# EAGLE design W7IUV_preamp (EAGLE 7.7.0)
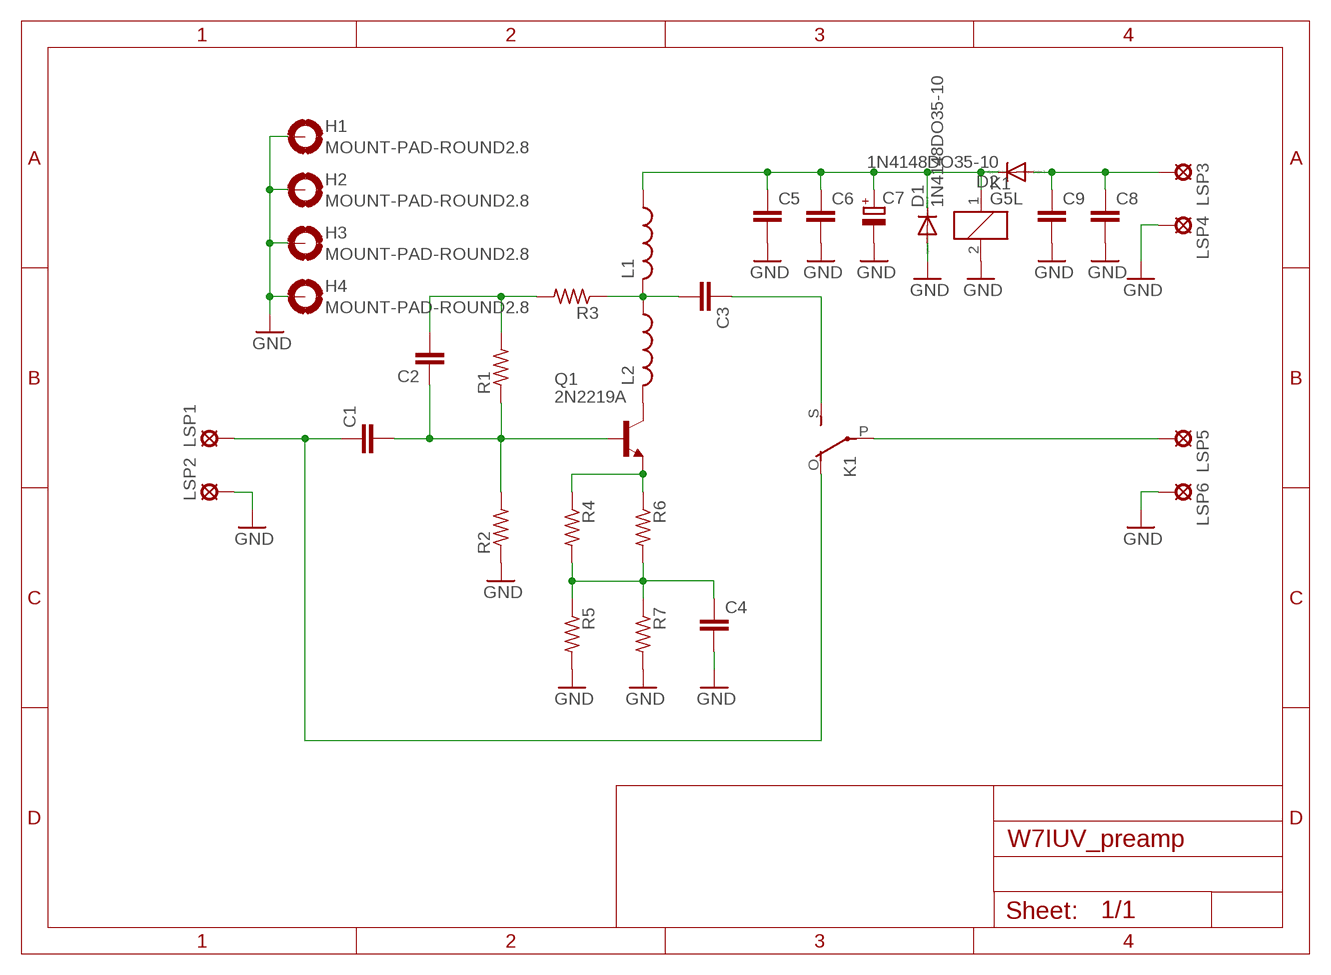
[diagram p0: schematic, sheet 1]

## Parts
C1  C-EUC1206  [C1206]
C2  C-EUC1206  [C1206]
C3  C-EUC1206  [C1206]
C4  C-EUC1206  [C1206]
C5  C-EUC1206  [C1206]
C6  C-EUC1206  [C1206]
C7  CPOL-EUE5-10.5  [E5-10,5]
C8  C-EUC1206  [C1206]
C9  C-EUC1206  [C1206]
D1  1N4148DO35-10  [DO35-10]
D2  1N4148DO35-10  [DO35-10]
H1  MOUNT-PAD-ROUND2.8  [2,8-PAD]
H2  MOUNT-PAD-ROUND2.8  [2,8-PAD]
H3  MOUNT-PAD-ROUND2.8  [2,8-PAD]
H4  MOUNT-PAD-ROUND2.8  [2,8-PAD]
K1  G5L  [G5LE]
L1  L-USLAN02KR  [LAN02KR]
L2  L-USLAN02KR  [LAN02KR]
LSP1  MCS08  [MCS08]
LSP2  MCS08  [MCS08]
LSP3  MCS08  [MCS08]
LSP4  MCS08  [MCS08]
LSP5  MCS08  [MCS08]
LSP6  MCS08  [MCS08]
Q1  2N2219A  [TO39]
R1  R-US_M1206  [M1206]
R2  R-US_M1206  [M1206]
R3  R-US_M1206  [M1206]
R4  R-US_M1206  [M1206]
R5  R-US_M1206  [M1206]
R6  R-US_M1206  [M1206]
R7  R-US_M1206  [M1206]

## Nets
GND: C4.2 C5.2 C6.2 C7.- C8.2 C9.2 D1.A H1.B2,8(MOUNT) H2.B2,8(MOUNT) H3.B2,8(MOUNT) H4.B2,8(MOUNT) K1.2 LSP2.MP LSP4.MP LSP6.MP R2.1 R5.2 R7.2
N$1: C4.1 R4.2 R5.1 R6.2 R7.1
N$2: Q1.1(E) R4.1 R6.1
N$3: C1.2 C2.1 Q1.2(B) R1.1 R2.2
N$4: C3.1 K1.S(2:S)
N$5: C2.2 R1.2 R3.2
N$6: C3.2 L1.2 L2.1 R3.1
N$7: L2.2 Q1.3(C)
N$8: C1.1 K1.O(2:O) LSP1.MP
N$9: K1.P(2:P) LSP5.MP
N$10: C5.1 C6.1 C7.+ D1.C D2.C K1.1 L1.1
N$11: C8.1 C9.1 D2.A LSP3.MP

## Library data of the parts
C1-C6 C8 C9 = rcl:C-EU: CAPACITOR, European symbol
C7 = rcl:CPOL-EU: POLARIZED CAPACITOR, European symbol
D1 D2 = diode:1N4148: DIODE high speed (Philips)
H1-H4 = holes:MOUNT-PAD-ROUND: MOUNTING PAD, round
K1 = relay:G5L: RELAY 1 x switch, 10 A/120 V AC, 8 A/30 V ADC, Omron; OC_FARNELL: unknown; OC_NEWARK: unknown
L1 L2 = rcl:L-US: INDUCTOR, American symbol
LSP1-LSP6 = solpad:MCS08: SOLDER PAD MC S0,8, drill 1.2 mm, distributor Buerklin, 08F130
Q1 = transistor-npn:2N2219A: NPN Transistor
R1-R7 = rcl:R-US_: RESISTOR, American symbol

## Board
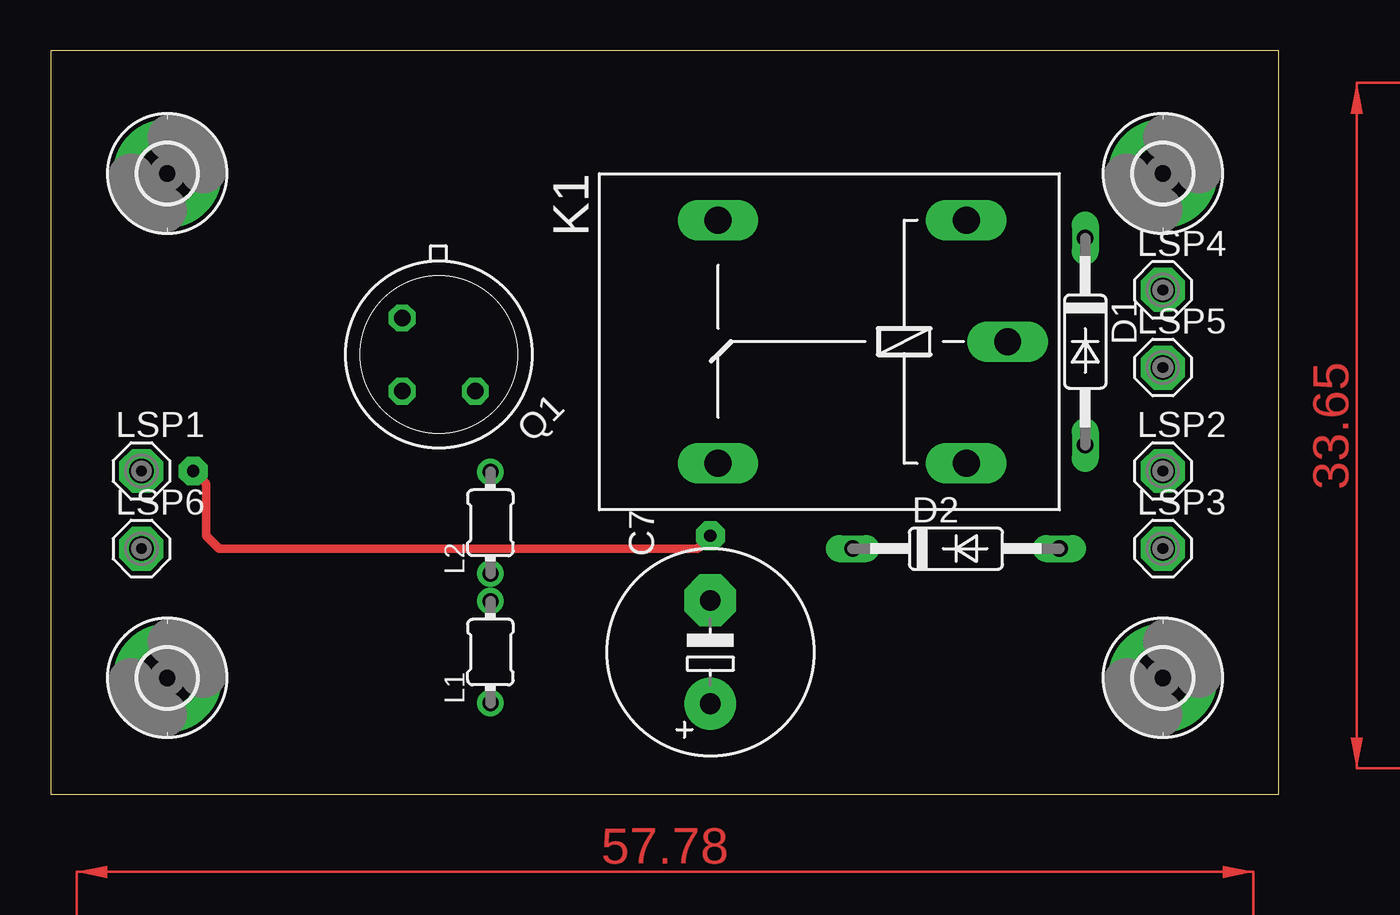
[diagram p1: board, top side]
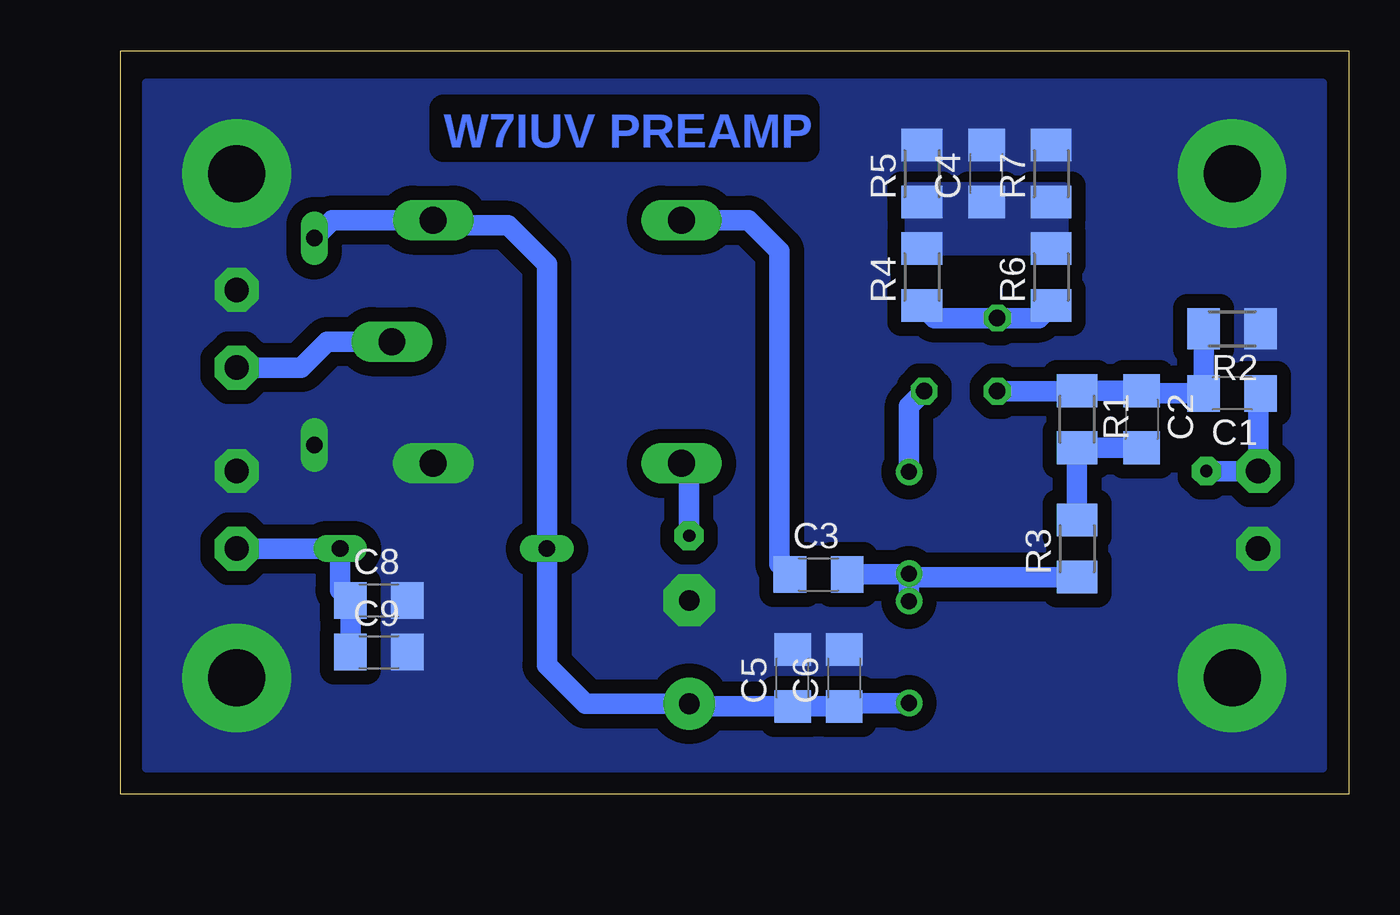
[diagram p2: board, bottom side, seen from below]

Size 60.3 x 36.5 mm. Coordinates in mm from the lower left corner, seen from the top.
Outline: 0,0 60.3,0 60.3,36.5 0,36.5 0,0
Copper layers (1*16): Top 0.035mm / dielectric 1.5mm / Bottom 0.035mm
Design rules "default": minimum track width 10mil, minimum drill 24mil, track to track 8mil, track to pad 8mil, pad to pad 8mil, via to via 8mil, smd to smd 8mil, copper to edge 40mil, drill to drill 8mil, minimum pad ring 10mil, minimum via ring 8mil, stop-mask expansion 4mil, vias tented up to drill 0mil, thermal gap 10mil
bRestrict: area 26.7,31.8 to 44.5,33.7

### Footprints (pad centres in the part's own frame; a part is rotated, then mirrored left to right if it is on the bottom)
C1206 = smd 1.6 x 1.8: 1 -1.4,0; 2 1.4,0
E5-10,5 = drill 1.016 pad 2.54: + -2.54,0 | drill 1.016 pad 2.54 octagon: - 2.54,0
DO35-10 = drill 0.813 long: A 5.08,0; C -5.08,0
2,8-PAD = drill 2.8 pad 5.334: B2,8 0,0
G5LE = drill 1.321 long: 1 -7.493,-5.969; 2 -7.493,5.969; O 4.699,5.969; P -9.525,0; S 4.699,-5.969
LAN02KR = drill 0.8 pad 1.3: 1 -2.5,0; 2 2.5,0
MCS08 = drill 1.194 pad 2.159 octagon: MP 0,0
TO39 = drill 0.813 octagon: 1 0,-2.54; 2 2.54,0; 3 0,2.54
M1206 = smd 1.6 x 2: 1 -1.4,0; 2 1.4,0

### Placement (x,y rotation side)
C1  5.71,19.68 180 bottom
C2  10.16,18.41 270 bottom
C3  26.04,10.79 0 bottom
C4  17.78,30.48 90 bottom
C5  27.3,5.71 90 bottom
C6  24.77,5.71 90 bottom
C7  32.38,6.99 90 top
C8  47.62,9.53 0 bottom
C9  47.62,6.99 0 bottom
D1  50.8,22.23 270 top
D2  44.45,12.06 0 top
H1  5.71,5.71 0 top
H2  54.61,5.71 0 top
H3  5.71,30.48 0 top
H4  54.61,30.48 0 top
K1  37.47,22.23 180 top
L1  21.59,6.99 90 top
L2  21.59,13.34 90 top
LSP1  4.45,15.88 0 top
LSP2  54.61,15.88 0 top
LSP3  54.61,12.06 0 top
LSP4  54.61,24.77 0 top
LSP5  54.61,20.95 0 top
LSP6  4.45,12.06 0 top
Q1  19.05,21.59 225 top
R1  13.34,18.41 270 bottom
R2  5.71,22.86 180 bottom
R3  13.34,12.06 90 bottom
R4  20.95,25.4 90 bottom
R5  20.95,30.48 90 bottom
R6  14.61,25.4 90 bottom
R7  14.61,30.48 90 bottom

### Tracks (layer width: path | path; a pad name or v marks a point on that pad's centre or on a via)
GND
  pour Bottom (isolate 0.7, no thermals): 1.27,34.92 59.05,34.92 59.05,1.27 1.27,1.27
N$1
  pour Bottom (no thermals): 13.97,29.84 21.59,29.84 21.59,26.67 13.97,26.67
N$2
  Bottom 1.016: R6.1 15.22,23.39 Q1.1 20.34,23.39 R4.1
N$3
  Bottom 1.016: R2.2 C1.2 10.03,19.68 C2.1 R1.1 13.36,19.79 Q1.2
N$4
  Bottom 1.016: K1.S 29.46,28.19 27.94,26.67 27.94,11.3 C3.1
N$5
  Bottom 1.016: C2.2 R1.2 R3.2
N$6
  Bottom 1.016: R3.1 21.42,10.66 L2.1 | L1.2 L2.1 | C3.2 21.63,10.79 L2.1
N$7
  Bottom 1.016: L2.2 21.59,19.05 Q1.3
N$8  (via drill 0.6 pad 1.42)
  Top 0.406: v6.99,15.88 7.62,15.24 7.62,12.7 8.26,12.06 31.75,12.06 v32.38,12.7
  Bottom 1.016: C1.1 4.45,19.55 LSP1.MP v6.99,15.88 | v32.38,12.7 32.38,15.88 K1.O
N$9
  Bottom 1.016: K1.P 50.16,22.23 51.44,20.95 LSP5.MP
N$10
  Bottom 1.016: L1.1 24.59,4.49 C6.1 C5.1 31.62,4.32 C7.+ 37.47,4.45 39.37,6.35 D2.C 39.37,26.04 41.27,27.94 44.7,27.94 K1.1 49.91,28.19 D1.C
N$11
  Bottom 1.016: LSP3.MP D2.A 49.53,10.03 C8.1 C9.1
(copper drawn outside any net)
  shapes: Top area x2

### Text on the board
Bottom: W7IUV PREAMP